# Altium project lab2_kulikov_buck.PrjPcb
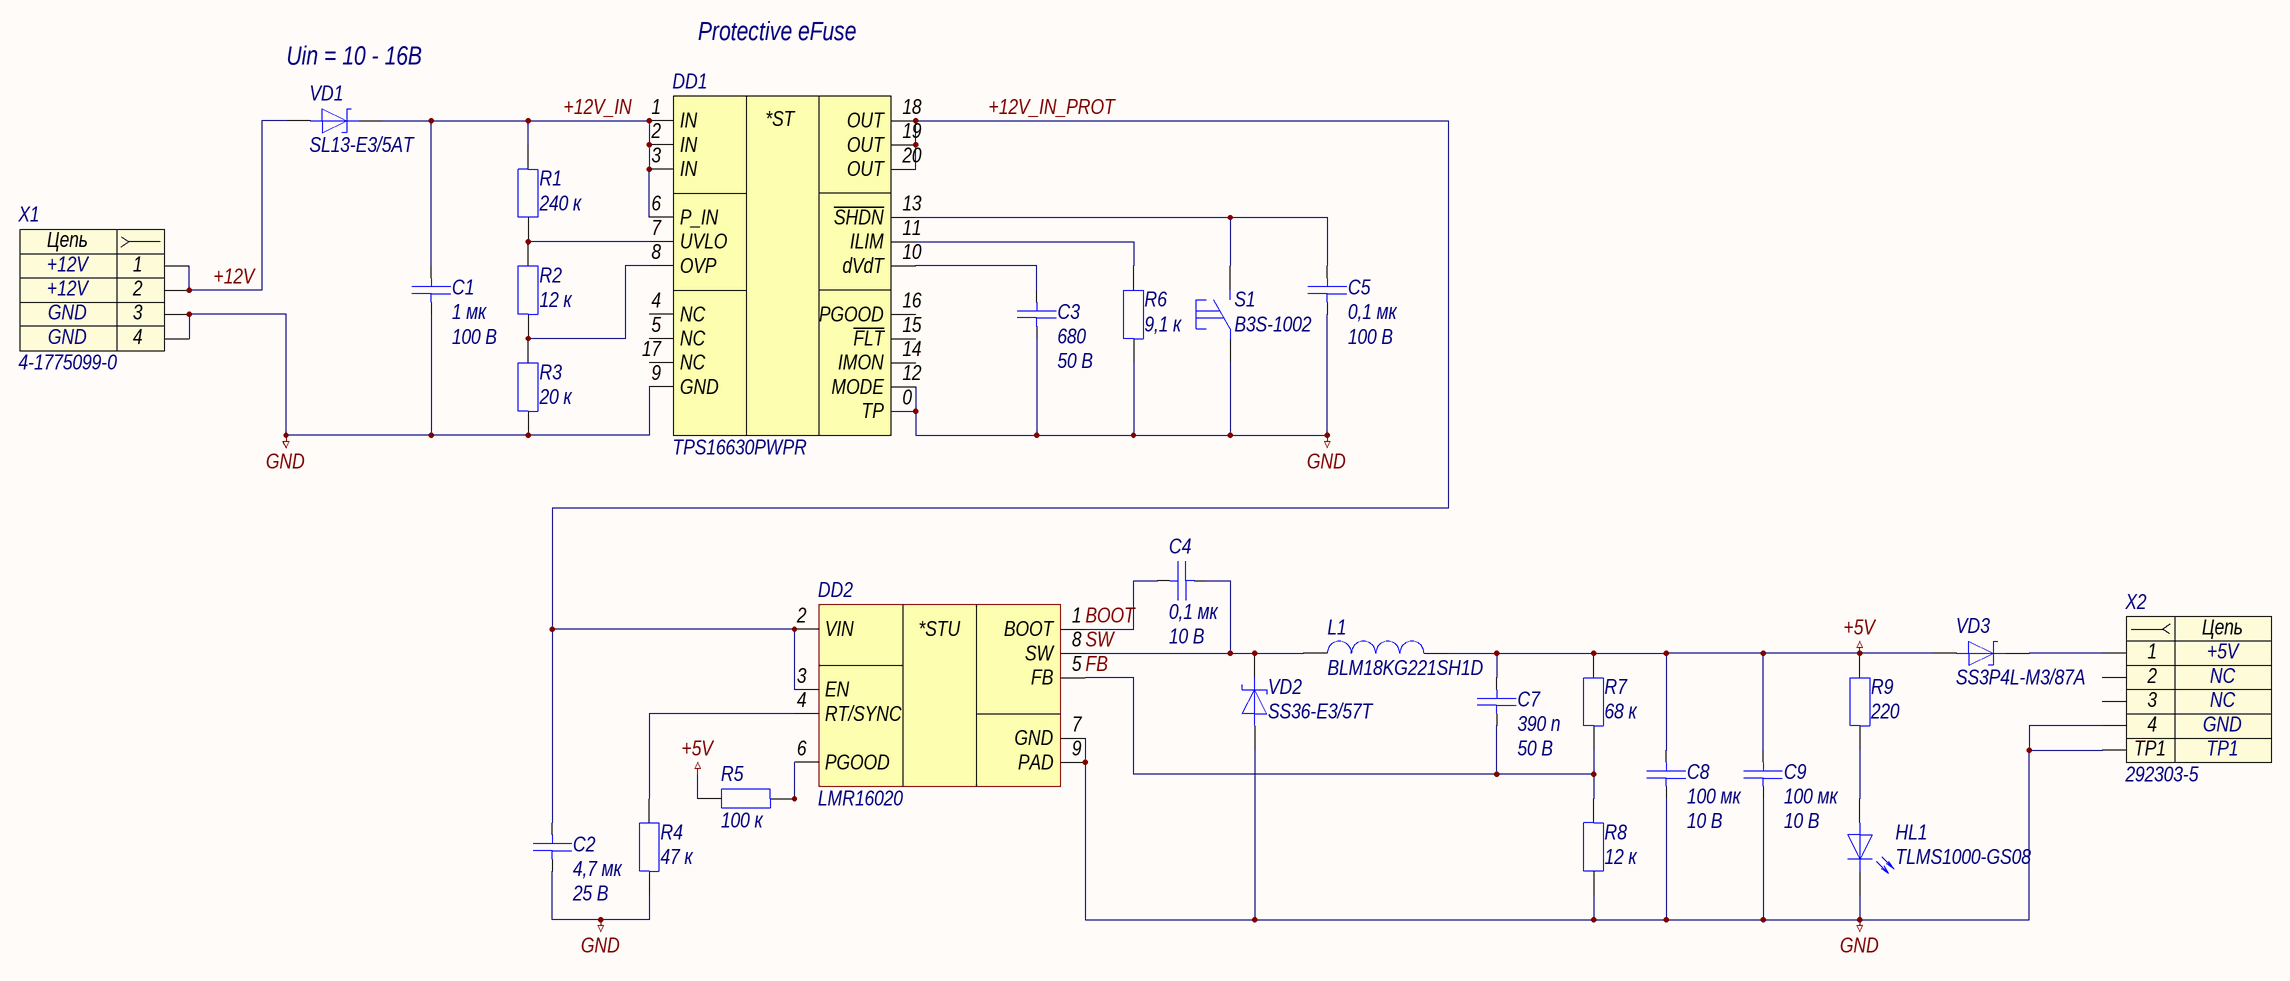
[diagram p0: lab2_kulikov_buck.SchDoc]
title_line_2: преобразователь; title_line_1: Понижающий; title: Понижающий преобразователь; sheets_total: 1; project: Понижающий преобразователь; pcb_dec_number: СПБПУ.3331506.014; document_type: Схема электрическая принципиальная; document_code: Ý3; developer: Куликов; designation: СПБПУ.3331506.014; check: Капустин; approver: Капустин
1 sheet, 27 parts. Net scope: global (net labels, ports and power ports of the same name join across sheets).
Board file: lab2_kulikov_buck.PcbDoc

## Sheet lab2_kulikov_buck.SchDoc: Понижающий преобразователь
size 594 x 420 mm; ApprovedBy: Капустин; CheckedBy: Капустин; DrawnBy: Куликов; DocumentNumber: СПБПУ.3331506.014Ý3; SheetNumber: n; SheetTotal: 1; DocumentCode: Ý3; ImagePath: СПБПУ.3331506.014

### Parts
C1  1 мк  Напряжение: 100 В  [C1206]
C2  4,7 мк  Напряжение: 25 В  [C1206]
C3  680  Напряжение: 50 В  [C0402]
C4  0,1 мк  Напряжение: 10 В  [C0402]
C5  0,1 мк  Напряжение: 100 В  [C0603]
C7  390 п  Напряжение: 50 В  [C0603]
C8  100 мк  Напряжение: 10 В  [C1206]
C9  100 мк  Напряжение: 10 В  [C1206]
DD1  TPS16630PWPR  [HTSSOP-20]
DD2  LMR16020  [SOIC127P600X170_HS-9N]
HL1  TLMS1000-GS08  [HL0603]
L1  BLM18KG221SH1D  [BLM-2-0603]
R1  240 к  [R0603]
R2  12 к  [R0603]
R3  20 к  [R0603]
R4  47 к  [R0603]
R5  100 к  [R0603]
R6  9,1 к  [R0603]
R7  68 к  [R0603]
R8  12 к  [R0603]
R9  220  [R0603]
S1  B3S-1002  [B3S-1002]
VD1  SL13-E3/5AT  [DO-214AC-510X270X229]
VD2  SS36-E3/57T  [DO-214AB]
VD3  SS3P4L-M3/87A  [TO-277A]
X1  4-1775099-0  [4-1775099-0]
X2  292303-5  [292303-5]

### Nets
+5V: C7.1 C8.1 C9.1 L1.2 R5.2 R7.2 R9.2 VD3.2
GND: C1.2 C2.2 C3.2 C5.2 C8.2 C9.2 DD1.0(TP) DD1.9(GND) DD1.12(MODE) DD2.7(GND) DD2.9(PAD) HL1.1 R3.1 R4.1 R6.1 R8.2 S1.1 VD2.2 X1.3 X1.4 X2.4 X2.TP1
+12V: VD1.2 X1.1 X1.2
+12V_IN: C1.1 DD1.1(IN) DD1.2(IN) DD1.3(IN) DD1.6(P_IN) R1.1 VD1.1
+12V_IN_PROT: C2.1 DD1.18(OUT) DD1.19(OUT) DD1.20(OUT) DD2.2(VIN) DD2.3(EN)
BOOT: C4.1 DD2.1(BOOT)
FB: C7.2 DD2.5(FB) R7.1 R8.1
SW: C4.2 DD2.8(SW) L1.1 VD2.1
NetC3_1: C3.1 DD1.10(dVdT)
NetC5_1: C5.1 DD1.13(~{SHDN}) S1.2
NetDD1_7: DD1.7(UVLO) R1.2 R2.2
NetDD1_8: DD1.8(OVP) R2.1 R3.2
NetDD1_11: DD1.11(ILIM) R6.2
NetDD2_4: DD2.4(RT/SYNC) R4.2
NetDD2_6: DD2.6(PGOOD) R5.1
NetHL1_2: HL1.2 R9.1
NetVD3_1: VD3.1 X2.1

Not connected (* = marked no-connect by the designer): DD1 4(NC) 5(NC) 14(IMON) 15(~{FLT}) 16(PGOOD) 17(NC); X2 2 3

### Notes on the sheet
- (near VD1) Uin = 10 - 16В
- Protective eFuse
- Перв. примен.
- Справ. №
- Подп. и дата
- Инв. № дубл.
- Нормоконтроль:
- Взам. инв. №
- Изм.
- Лист
- № докум.
- Подп.
- Дата
- Лит.
- Масса
- Масштаб
- Т.контр.
- Пров.
- Разраб.
- Листов
- Разработал:
- Инв. № подл.
- Н.контр.
- Утв.
- Копировал
- Формат
- А2
- (in symbol Component_1) *STU
- (in symbol dd0002) *ST
- (in symbol x0003) Цепь
- (in symbol x0004) Цепь

### Library data of the parts
C1 = c0098: =Описание; ID: c0098; Фамилия: Ларионов; Описание: Конденсатор керамический чип 1206 1 мкФ 100 В ±10 %; Наименование: CC1206KKX7R0BB105; Производитель: YAGEO Corp.; Отклонение: ±10 %; Рабочие температуры: от –55 °С до +125 °С; Температурный коэффициент емкости: X7R; Корпус: 1206; Номинал: 1 мк; Номинальное напряжение: 100 В; HelpURL: https://www.yageo.com/upload/media/product/productsearch/datasheet/mlcc/UPY-NP0X7R_MV_100-to-630V_22.pdf
C2 = c0105: =Описание; ID: c0122; Фамилия: Куликов; Описание: Конденсатор чип 1206 4,7 мкФ 25 В ±10 %; Наименование: GRM31CR71E475KA88L; Производитель: MuRata; Отклонение: ±10 %; Рабочие температуры: от –55 °С до +125 °С; Температурный коэффициент емкости: X7R; Корпус: 1206; Номинал: 4,7 мк; Номинальное напряжение: 25 В; HelpURL: https://www.murata.com/en-global/search/productsearch?cate=cgCapacitors&partno=GRM31CR71E475KA88L
C3 = c0004: =Описание; ID: c0122; Фамилия: Куликов; Описание: Конденсатор чип 0402 680 пФ 50 В ±1 %; Наименование: CC0402JRNPO9BN681; Производитель: YAGEO; Отклонение: ±5 %; Рабочие температуры: от –55 °С до +125 °С; Температурный коэффициент емкости: C0G; Корпус: 0402; Номинал: 680; Номинальное напряжение: 50 В; HelpURL: https://www.yageo.com/upload/media/product/productsearch/datasheet/mlcc/UPY-GP_NP0_16V-to-50V_18.pdf
C4 = c0006: =Описание; ID: c0119; Фамилия: Куликов; Описание: Конденсатор чип 0402 100 нФ 10 В ±10 %; Наименование: GRM155R71A104KA01D; Производитель: MuRata; Отклонение: ±10 %; Рабочие температуры: от –55 °С до +125 °С; Температурный коэффициент емкости: C0G; Корпус: 0402; Номинал: 0,1 мк; Номинальное напряжение: 10 В; HelpURL: https://www.murata.com/en-eu/products/productdetail?partno=GRM155R71A104KA01%23
C5 = c0018: =Описание; ID: c0018; Фамилия: Ларионов; Описание: Конденсатор чип 0603 0,1 мкФ 100 В ±10 %; Наименование: CC0603KRX7R0BB104; Производитель: YAGEO Corp.; Отклонение: ±10 %; Рабочие температуры: от -55 °С до +125 °С; Корпус: 0603; Номинал: 0,1 мк; Номинальное напряжение: 100 В; HelpURL: https://www.yageo.com/upload/media/product/productsearch/datasheet/mlcc/UPY-NP0X7R_MV_100-to-630V_22.pdf
C7 = c0019: =Описание; ID: c0120; Фамилия: Куликов; Описание: Конденсатор чип 0603 390 пФ 50 В ±10 %; Наименование: GRM1885C1H391JA01D; Производитель: MuRata; Отклонение: ±10 %; Рабочие температуры: от –55 °С до +125 °С; Температурный коэффициент емкости: X7R; Корпус: 0603; Номинал: 390 п; Номинальное напряжение: 50 В; HelpURL: https://www.yageo.com/upload/media/product/products/datasheet/mlcc/UPY-GPHC_X7R_6.3V-to-50V_20.pdf
C8 C9 = c0105: =Описание; ID: c0121; Фамилия: Куликов; Описание: Конденсатор чип 1206 100мкФ 10 В ±10 %; Наименование: C3216X5R1A107M160AC; Производитель: TDK; Отклонение: ±10 %; Рабочие температуры: от –55 °С до +85 °С; Температурный коэффициент емкости: X5R; Корпус: 1206; Номинал: 100 мк; Номинальное напряжение: 10 В; HelpURL: https://product.tdk.com/info/en/catalog/datasheets/mlcc_commercial_general_en.pdf
DD1 = dd0002: =Описание; ID: dd0002; Фамилия: Жернаков; Описание: Защитная микросхема eFuse 60 В и 6 А; Производитель: Texas Instruments; Напряжение: от 4,5 В до 60 В; Максимальное напряжение: 67 В; Ток: от 0,6 А до 6 А; Рабочие температуры: от -40 °С до +125 °С; Наименование: TPS16630PWPR; Корпус: HTSSOP-20; HelpURL: https://www.ti.com/product/TPS1663
DD2 = Component_1
HL1 = hl0001: =Описание; ID: hl0001; Фамилия: Ларионов; Описание: Светодиод чип 0603 красный; Производитель: Vishay Intertechnology, Inc.; Цвет: Red; Номинальная сила света: 4 мкд; Номинальная длина волны: 628 нм; Номинальный прямой ток: 15 мА; Номинальное падение напряжения: 1,8 В; Рассеиваемая мощность: 40 мВт; Рабочие температуры: от –40 °С до +100 °С; Корпус: 0603; Наименование: TLMS1000-GS08; HelpURL: https://www.vishay.com/leds/list/product-83172/
L1 = l0001: =Описание; ID: l0001; Фамилия: Ларионов; Описание: Ферритовая бусина 220 Ом ±25 %; Производитель: Murata Manufacturing Co., Ltd.; Сопротивление, 100 МГц: 220 Ом; Отклонение, 100 МГц: ±25 %; Сопротивление при постоянном токе: 0,05 Ом; Рабочие температуры: от –55 °С до +125 °С; Корпус: 0603; Наименование: BLM18KG221SH1D; HelpURL: https://www.murata.com/en-global/products/productdetail?partno=BLM18KG221SH1%23
R1 = r0108: =Описание; ID: r0108; Фамилия: Паньков; Описание: Резистор чип 0603 240 кОм ±1 % 0,1 Вт; Наименование: RC0603FR-07240KL; Производитель: YAGEO Corp.; Отклонение: ±1 %; Номинальное напряжение: 75 В; Рабочие температуры: от –55 °С до +155 °С; Номинальный ток: 1 А; Корпус: 0603; Номинал: 240 к; HelpURL: https://www.yageo.com/upload/media/product/productsearch/datasheet/rchip/PYu-RC_Group_51_RoHS_L_11.pdf
R2 = r0064: =Описание; ID: r0064; Фамилия: Соколов; Описание: Резистор чип 0603 12 кОм ±1 % 0,1 Вт; Наименование: AC0603FR-1012KL; Производитель: YAGEO Corp.; Отклонение: ±1 %; Номинальное напряжение: 75 В; Рабочие температуры: от –55 °С до +155 °С; Номинальный ток: 1 А; Корпус: 0603; Номинал: 12 к; HelpURL: https://www.yageo.com/upload/media/product/productsearch/datasheet/rchip/PYu-AC_51_RoHS_L_7.pdf
R3 = r0070: =Описание; ID: r0070; Фамилия: Паньков; Описание: Резистор чип 0603 20 кОм ±1 % 0,1 Вт; Наименование: RC0603FR-0720KL; Производитель: YAGEO Corp.; Отклонение: ±1 %; Номинальное напряжение: 75 В; Рабочие температуры: от –55 °С до +155 °С; Номинальный ток: 1 А; Корпус: 0603; Номинал: 20 к; HelpURL: https://www.yageo.com/upload/media/product/productsearch/datasheet/rchip/PYu-RC_Group_51_RoHS_L_11.pdf
R4 = r0083: =Описание; ID: r0083; Фамилия: Паньков; Описание: Резистор чип 0603 47 кОм ±1 % 0,1 Вт; Наименование: RC0603FR-0747KL; Производитель: YAGEO Corp.; Отклонение: ±1 %; Номинальное напряжение: 75 В; Рабочие температуры: от –55 °С до +155 °С; Номинальный ток: 1 А; Корпус: 0603; Номинал: 47 к; HelpURL: https://www.yageo.com/upload/media/product/productsearch/datasheet/rchip/PYu-RC_Group_51_RoHS_L_11.pdf
R5 = r0023: =Описание; ID: r0023; Фамилия: Водорезов; Описание: Резистор чип 0603 100 кОм ±1 % 0,2 Вт; Наименование: RC0603FR-07100KL; Производитель: YAGEO Corp.; Отклонение: ±1 %; Номинальное напряжение: 75 В; Рабочие температуры: от -55 °С до +155 °С; Номинальный ток: 1 А; Корпус: 0603; Номинал: 100 к; HelpURL: https://www.yageo.com/upload/media/product/productsearch/datasheet/rchip/PYu-RC_Group_51_RoHS_L_11.pdf
R6 = r0059: =Описание; ID: r0059; Фамилия: Паньков; Описание: Резистор чип 0603 9,1 кОм ±1 % 0,1 Вт; Наименование: RC0603FR-079K1L; Производитель: YAGEO Corp.; Отклонение: ±1 %; Номинальное напряжение: 75 В; Рабочие температуры: от –55 °С до +155 °С; Номинальный ток: 1 А; Корпус: 0603; Номинал: 9,1 к; HelpURL: https://www.yageo.com/upload/media/product/productsearch/datasheet/rchip/PYu-RC_Group_51_RoHS_L_11.pdf
R7 = r0089: =Описание; ID: r0089; Фамилия: Паньков; Описание: Резистор чип 0603 68 кОм ±1 % 0,1 Вт; Наименование: RC0603FR-0768KL; Производитель: YAGEO Corp.; Отклонение: ±1 %; Номинальное напряжение: 75 В; Рабочие температуры: от –55 °С до +155 °С; Номинальный ток: 1 А; Корпус: 0603; Номинал: 68 к; HelpURL: https://www.yageo.com/upload/media/product/productsearch/datasheet/rchip/PYu-RC_Group_51_RoHS_L_11.pdf
R8 = r0063: =Описание; ID: r0063; Фамилия: Паньков; Описание: Резистор чип 0603 12 кОм ±1 % 0,1 Вт; Наименование: RC0603FR-0712KL; Производитель: YAGEO Corp.; Отклонение: ±1 %; Номинальное напряжение: 75 В; Рабочие температуры: от –55 °С до +155 °С; Номинальный ток: 1 А; Корпус: 0603; Номинал: 12 к; HelpURL: https://www.yageo.com/upload/media/product/productsearch/datasheet/rchip/PYu-RC_Group_51_RoHS_L_11.pdf
R9 = r0009: =Описание; ID: r0009; Фамилия: Ларионов; Описание: Резистор чип 0603 220 Ом ±1 % 0,1 Вт; Наименование: RC0603FR-07220RL; Производитель: YAGEO Corp.; Отклонение: ±1 %; Номинальное напряжение: 75 В; Рабочие температуры: от -55 °С до +155 °С; Номинальный ток: 1 А; Корпус: 0603; Номинал: 220; HelpURL: https://www.yageo.com/upload/media/product/productsearch/datasheet/rchip/PYu-RC_Group_51_RoHS_L_11.pdf
S1 = s0003: =Описание; ID: s0003; Фамилия: Засецкий; Описание: Тактовая кнопка поверхностного монтажа; Производитель: OMRON Corporation; Ток нагрузки: 50 мА @ 24 В; Сопротивление контакта: 100 мОм; Количество контактов: 4; Рабочие температуры: от –25 °С до +70 °С; Промывка: Разрешена; Корпус: 6,00 x 6,60 x 4,30; Наименование: B3S-1002; HelpURL: https://components.omron.com/product-detail?partId=468
VD1 = vd0003: =Описание; ID: vd0003; Фамилия: Ларионов; Описание: Диод Шоттки 30 В 1,5 А; Производитель: Vishay Intertechnology, Inc.; Максимальное прямое напряжение: 0,445 В; Максимальное обратное напряжение: 30 В; Максимальный прямой ток: 1,5 А; Рабочие температуры: от –55 °С до +125 °С; Корпус: DO-214AC; Наименование: SL13-E3/5AT; HelpURL: https://www.vishay.com/product?docid=88740
VD2 = vd0004: =Описание; ID: vd0004; Фамилия: Жернаков; Описание: Диод Шоттки 60 В 3 А; Производитель: Vishay Intertechnology, Inc.; Пиковое прямое напряжение: 0,75 В; Импульсное обратное напряжение: 60 В; Макс допустимый средний прямой ток: 3 А; Рабочие температуры: от –55 °С до +150 °С; Наименование: SS36-E3/57T; Корпус: DO-214AB; HelpURL: https://www.vishay.com/product?docid=88751
VD3 = vd0003: =Описание; ID: vd0003; Фамилия: Ларионов; Описание: Диод Шоттки 40 В 3 А; Производитель: Vishay Intertechnology, Inc.; Пиковое прямое напряжение: 0,47 В; Импульсное обратное напряжение: 40 В; Макс допустимый средний прямой ток: 3 А; Рабочие температуры: от –55 °С до +150 °С; Наименование: SS3P4L-M3/87A; Корпус: TO-277A; HelpURL: https://www.vishay.com/diodes/list/product-88986/
X1 = x0004: =Описание; Contact_1: +12V; Contact_3: GND; ID: x0004; Фамилия: Ларионов; Описание: ATX Power 4 pin гнездо прямой; Производитель: TE Connectivity; Contact_2: +12V; Contact_4: GND; Наименование: 4-1775099-0; HelpURL: https://www.te.com/usa-en/product-4-1775099-0.html
X2 = x0003: =Описание; Contact_1: +5V; Contact_2: NC; Contact_4: GND; ID: x0003; Фамилия: Ларионов; Описание: USB 2.0 Type A гнездо; Производитель: TE Connectivity; Contact_3: NC; Наименование: 292303-5; HelpURL: https://www.te.com/usa-en/product-292303-5.html